# EAGLE board watchplb (EAGLE 6.5.0), part 1 of 2
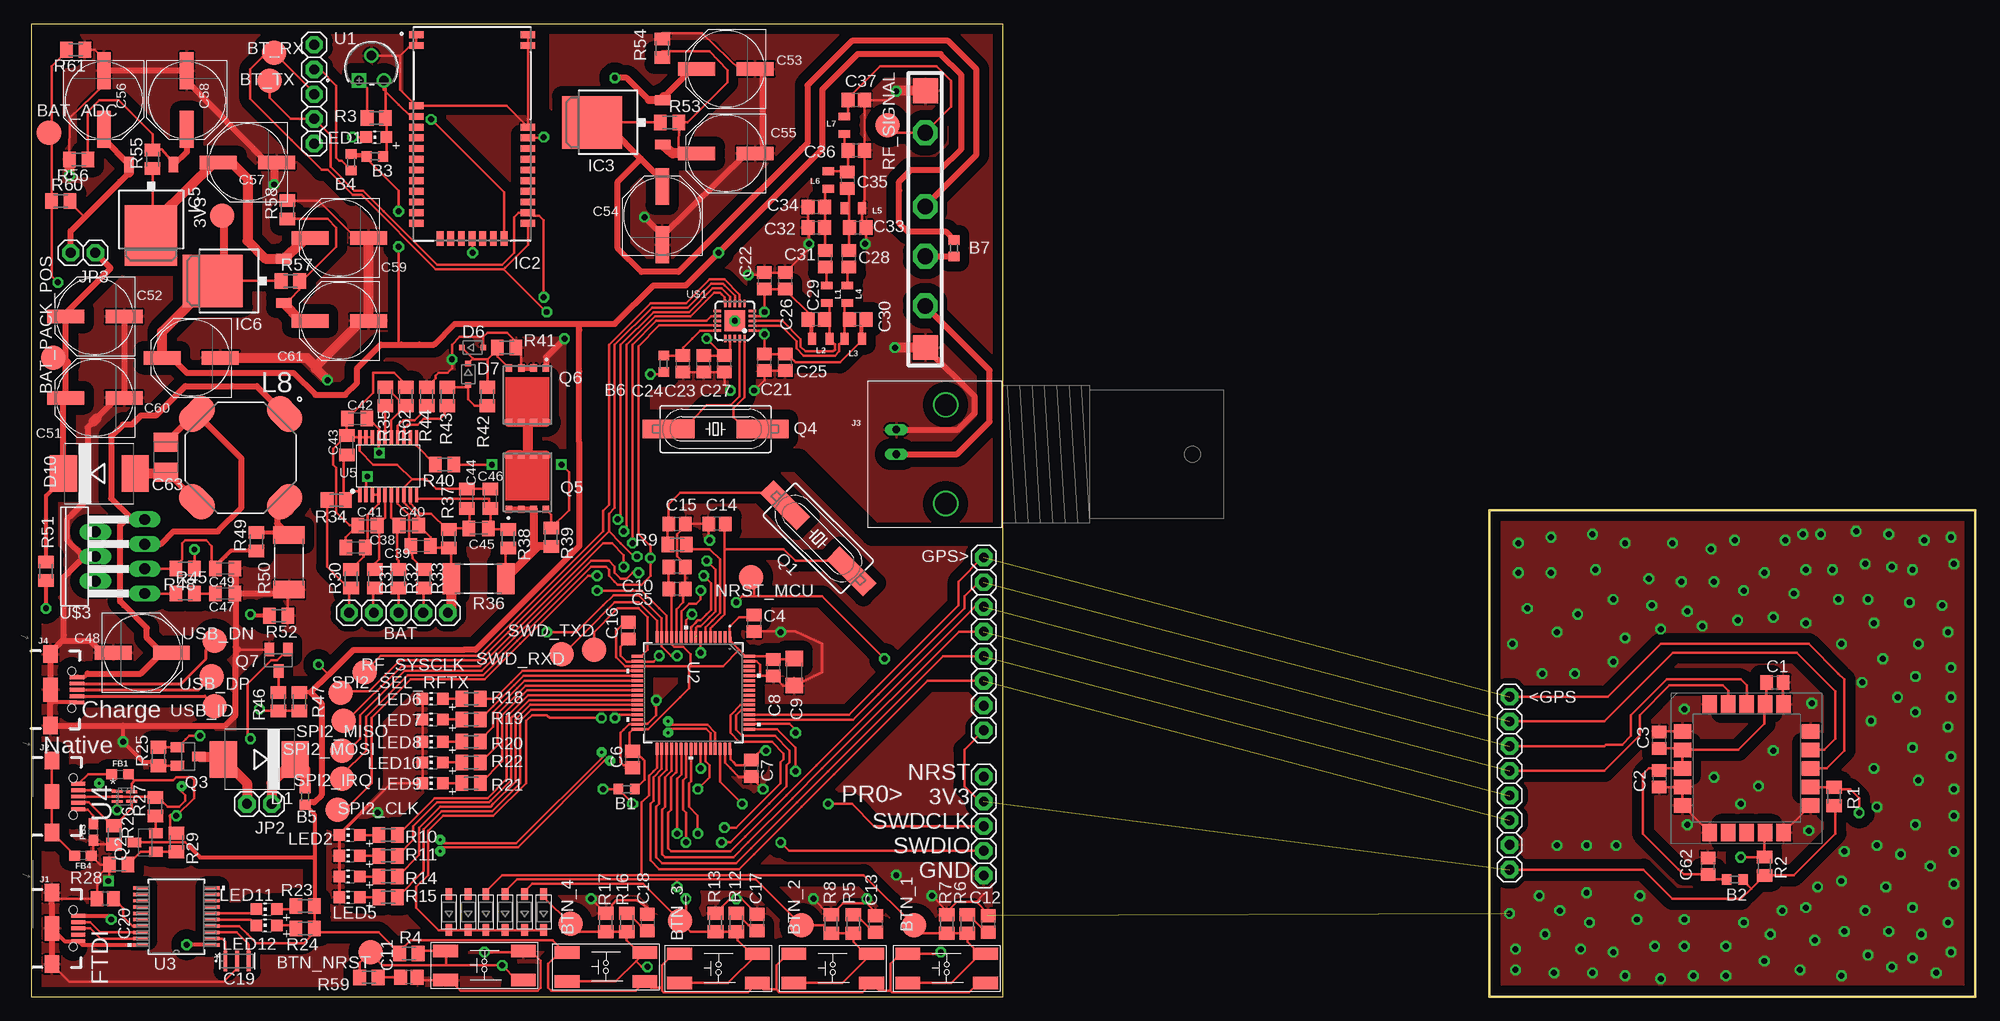
[diagram p2: board, top side]
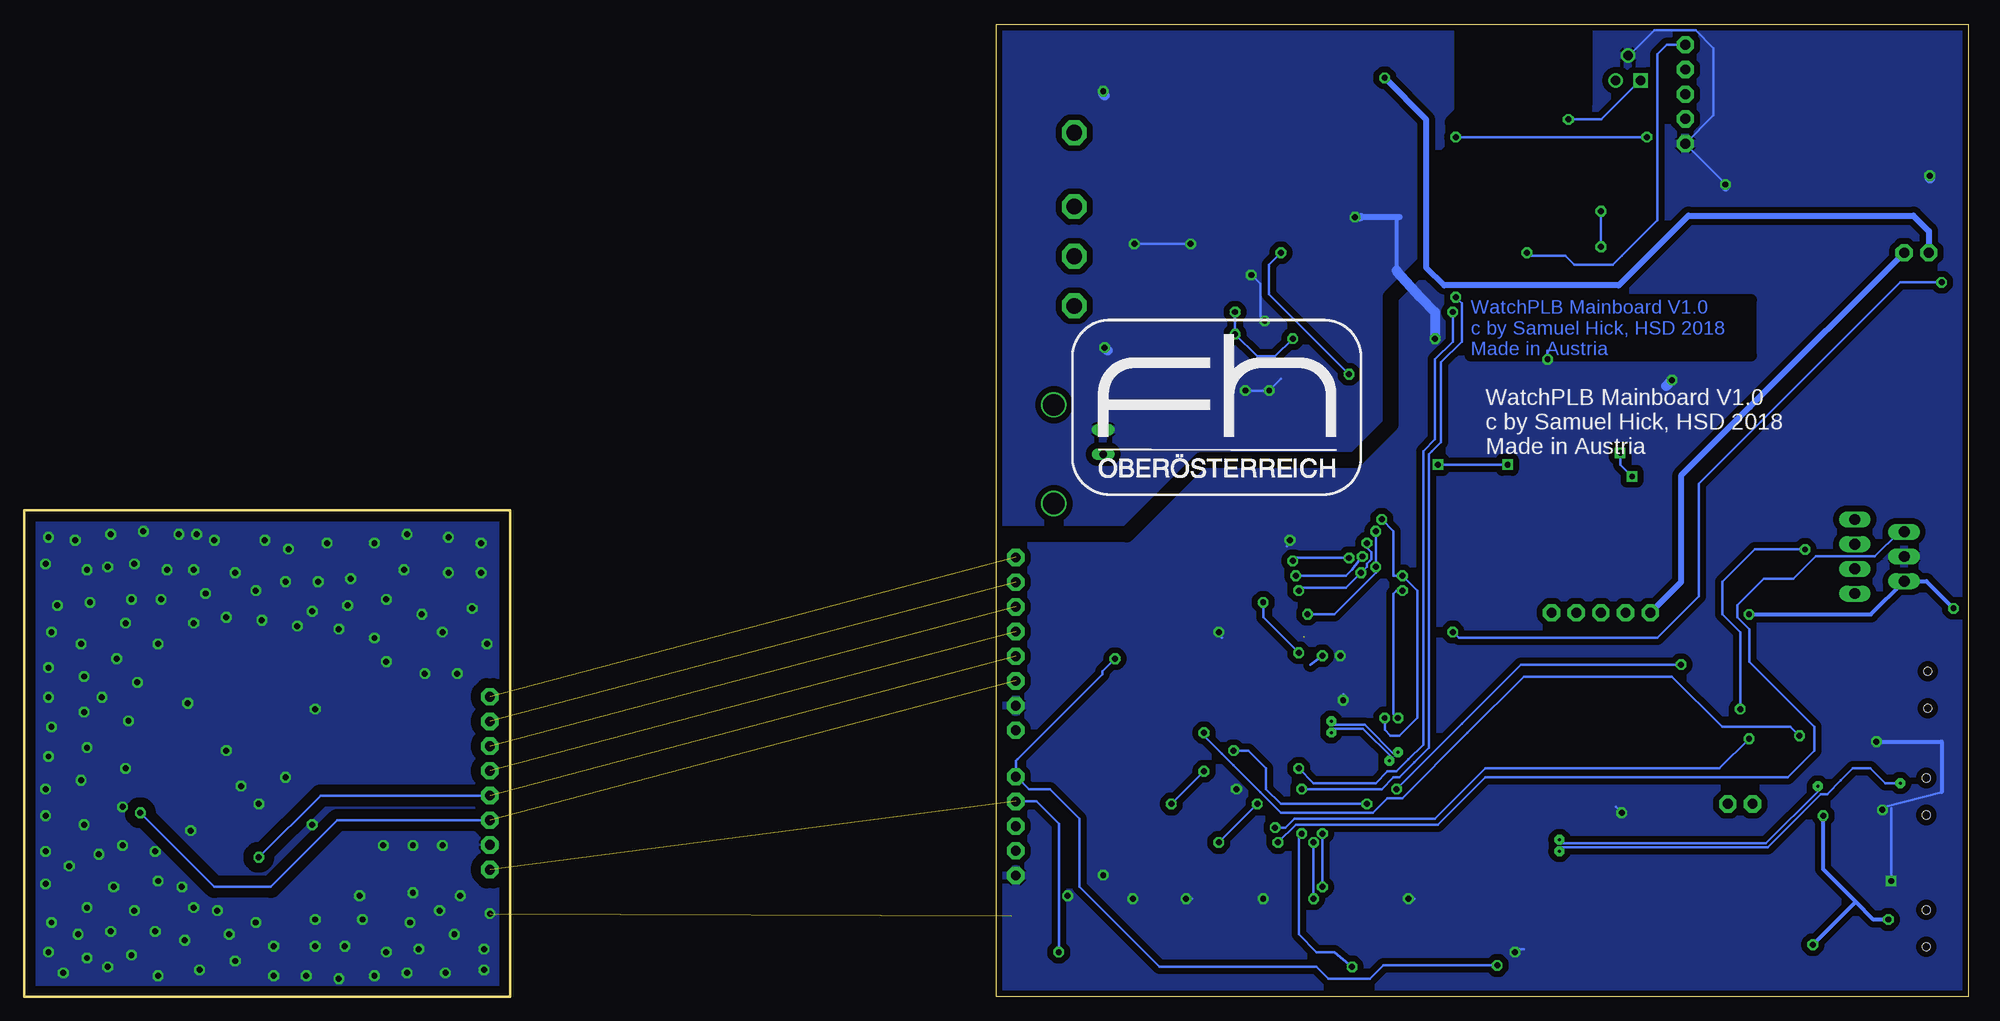
[diagram p3: board, bottom side, seen from below]

Size 200 x 100 mm. Coordinates in mm from the lower left corner, seen from the top.
Outline: 0,0 100,0 100,100 0,100 0,0
Outline: 200,50 200,0 150,0 150,50 200,50
Copper layers (1*16): Top 0.035mm / dielectric 1.5mm / Bottom 0.035mm
Design rules "PCB-POOL Standard *": minimum track width 0.15mm, minimum drill 0.3mm, track to track 0.15mm, track to pad 0.15mm, pad to pad 0.15mm, via to via 0.15mm, smd to smd 0.15mm, copper to edge 0.3mm, drill to drill 0.2mm, minimum pad ring 0.2mm, minimum via ring 0.15mm, stop-mask expansion 0.075mm, vias tented up to drill 0mil, thermal gap 0.2mm
tRestrict: area 39.3,91.7 to 51.2,99.7; 14 lines
bRestrict: area 39.3,91.7 to 51.2,99.7; 11 lines

## Footprints (pad centres in the part's own frame; a part is rotated, then mirrored left to right if it is on the bottom)
B2,54 = smd 2.54 x 2.54: TP 0,0
1X08 = drill 1.016 pad 1.778 octagon: 1 -8.89,0; 2 -6.35,0; 3 -3.81,0; 4 -1.27,0; 5 1.27,0; 6 3.81,0; 7 6.35,0; 8 8.89,0
L0603 = smd 1 x 1.1: 1 -0.85,0; 2 0.85,0
1X05 = drill 1.016 pad 1.778 octagon: 1 -5.08,0; 2 -2.54,0; 3 0,0; 4 2.54,0; 5 5.08,0
C0805 = smd 1.3 x 1.5: 1 -0.85,0; 2 0.85,0
C1206 = smd 1.6 x 1.8: 1 -1.4,0; 2 1.4,0
CSTCE = smd 0.406 x 2.108: 1 -1.2,0; 2 0,0; 3 1.2,0
C0805K = smd 1.3 x 1.6: 1 -1,0; 2 1,0
PANASONIC_E = smd 3.8 x 1.4: + 3,0; - -3,0
B/3528-21R = smd 1.95 x 2.5: + 1.525,0; - -1.525,0
SMC = smd 2.8 x 3.8: A 3.7,0; C -3.7,0
SOD-123 = smd 1.2 x 0.7: A 1.85,0; C -1.85,0
SOD323-R = smd 0.6 x 0.6: A 1.1,0; C -1.1,0
0603 = smd 1.1 x 1: 1 -0.85,0; 2 0.85,0
SAM-M8Q = smd 1.8 x 1.5: 1 -6.6,3.8; 2 -6.6,1.9; 3 -6.6,0; 4 -6.6,-1.9; 5 -6.6,-3.8; 11 6.6,-3.8; 12 6.6,-1.9; 13 6.6,0; 14 6.6,1.9; 15 6.6,3.8 | smd 1.5 x 1.8: 6 -3.8,-6.6; 7 -1.9,-6.6; 8 0,-6.6; 9 1.9,-6.6; 10 3.8,-6.6; 16 3.8,6.6; 17 1.9,6.6; 18 0,6.6; 19 -1.9,6.6; 20 -3.8,6.6
BM78SPPS5NC2_1 = smd 1.5 x 0.7: 1 -11.75,21.2; 2 -11.75,20.1; 3 -11.75,13.9; 4 -11.75,12.8; 5 -11.75,11.7; 6 -11.75,10.6; 7 -11.75,9.5; 8 -11.75,8.4; 9 -11.75,7.3; 10 -11.75,6.2; 11 -11.75,5.1; 12 -11.75,4; 13 -11.75,2.9; 14 -11.75,1.8; 22 -0.25,1.8; 23 -0.25,2.9; 24 -0.25,4; 25 -0.25,5.1; 26 -0.25,6.2; 27 -0.25,7.3; 28 -0.25,8.4; 29 -0.25,9.5; 30 -0.25,10.6; 31 -0.25,11.7; 32 -0.25,20.1; 33 -0.25,21.2 | smd 0.7 x 1.5: 15 -9.3,0.25; 16 -8.2,0.25; 17 -7.1,0.25; 18 -6,0.25; 19 -4.9,0.25; 20 -3.8,0.25; 21 -2.7,0.25
TO252 = smd 1 x 1.6: 1 -2.28,-4.8; 2 2.28,-4.8 | smd 5.4 x 6.2: TAB 0,2.5
USB-B-MICRO-SMD = smd 1.45 x 0.4: D+ 2.725,0; D- 2.725,0.65; GND 2.725,-1.3; ID 2.725,-0.65; VBUS 2.725,1.3 | smd 1.5 x 1.8: SHIELD1 0,3.685; SHIELD2 0,-3.685 | smd 1.5 x 2.5: SHIELD3 0,0 | hole 0.85: 2.2,1.9; 2.2,-1.9
BNC = drill 2.2: 3 -5.08,5.08; 4 5.08,5.08 | drill 0.8 long: GND -2.54,0; S 0,0
1X02 = drill 1.016 pad 1.778 octagon: 1 -1.27,0; 2 1.27,0
0805 = smd 0.8 x 1.2: 1 -0.9,0; 2 0.9,0
INDM115115X635N = smd 2.769 x 4.064: 1 -6.375,0; 3 6.375,0 | smd 4.064 x 2.769: 2 0,-6.375; 4 0,6.375
CHIP-LED0805 = smd 1.2 x 1.2: A 0,-1.05; C 0,1.05
HC49UP = smd 5.334 x 1.93: 1 -4.826,0; 2 4.826,0
SOT23-BEC = smd 1 x 1.4: B -0.95,-1.1; C 0,1.1; E 0.95,-1.1
SOT23 = smd 1 x 1.4: 1 -0.95,-1.1; 2 0.95,-1.1; 3 0,1.1
TRANS_CSD18534Q5A = smd 0.75 x 0.68: 1 -2.77,1.905; 2 -2.77,0.635; 3 -2.77,-0.635; 4 -2.77,-1.905 | smd 0.66 x 0.68: 5 2.78,-1.905; 6 2.78,-0.635; 7 2.78,0.635; 8 2.78,1.905
M0805 = smd 1.3 x 1.6: 1 -0.95,0; 2 0.95,0
R2512 = smd 1.8 x 3.2: 1 -2.8,0; 2 2.8,0
SMD_SWITCH = smd 2.54 x 1.27: P$1 4,1.5; P$2 -4,-1.5; P$3 -4,1.5; P$4 4,-1.5
TO-92_MC = drill 0.991 pad 1.499 square: 1 -2.54,-2.54 | drill 0.991 pad 1.499: 2 -1.27,0; 3 0,-2.54
LQFP64-10X10MM = smd 1.194 x 0.305: 1 -5.75,3.75; 2 -5.75,3.25; 3 -5.75,2.75; 4 -5.75,2.25; 5 -5.75,1.75; 6 -5.75,1.25; 7 -5.75,0.75; 8 -5.75,0.25; 9 -5.75,-0.25; 10 -5.75,-0.75; 11 -5.75,-1.25; 12 -5.75,-1.75; 13 -5.75,-2.25; 14 -5.75,-2.75; 15 -5.75,-3.25; 16 -5.75,-3.75; 33 5.75,-3.75; 34 5.75,-3.25; 35 5.75,-2.75; 36 5.75,-2.25; 37 5.75,-1.75; 38 5.75,-1.25; 39 5.75,-0.75; 40 5.75,-0.25; 41 5.75,0.25; 42 5.75,0.75; 43 5.75,1.25; 44 5.75,1.75; 45 5.75,2.25; 46 5.75,2.75; 47 5.75,3.25; 48 5.75,3.75 | smd 0.305 x 1.194: 17 -3.75,-5.75; 18 -3.25,-5.75; 19 -2.75,-5.75; 20 -2.25,-5.75; 21 -1.75,-5.75; 22 -1.25,-5.75; 23 -0.75,-5.75; 24 -0.25,-5.75; 25 0.25,-5.75; 26 0.75,-5.75; 27 1.25,-5.75; 28 1.75,-5.75; 29 2.25,-5.75; 30 2.75,-5.75; 31 3.25,-5.75; 32 3.75,-5.75; 49 3.75,5.75; 50 3.25,5.75; 51 2.75,5.75; 52 2.25,5.75; 53 1.75,5.75; 54 1.25,5.75; 55 0.75,5.75; 56 0.25,5.75; 57 -0.25,5.75; 58 -0.75,5.75; 59 -1.25,5.75; 60 -1.75,5.75; 61 -2.25,5.75; 62 -2.75,5.75; 63 -3.25,5.75; 64 -3.75,5.75
SSOP20_MC = smd 1.473 x 0.356: 1 -3.708,2.926; 2 -3.708,2.276; 3 -3.708,1.626; 4 -3.708,0.975; 5 -3.708,0.325; 6 -3.708,-0.325; 7 -3.708,-0.975; 8 -3.708,-1.626; 9 -3.708,-2.276; 10 -3.708,-2.926; 11 3.708,-2.926; 12 3.708,-2.276; 13 3.708,-1.626; 14 3.708,-0.975; 15 3.708,-0.325; 16 3.708,0.325; 17 3.708,0.975; 18 3.708,1.626; 19 3.708,2.276; 20 3.708,2.926
SOT50P160X60-5N = smd 1.118 x 0.254: 1 -0.737,0.508; 2 -0.737,0; 3 -0.737,-0.508 | smd 1.118 x 0.305: 4 0.737,-0.508; 5 0.737,0.508
TSSOP-20/6MM = smd 1.5 x 0.35: 1 -2.95,2.925; 2 -2.95,2.275; 3 -2.95,1.625; 4 -2.95,0.975; 5 -2.95,0.325; 6 -2.95,-0.325; 7 -2.95,-0.975; 8 -2.95,-1.625; 9 -2.95,-2.275; 10 -2.95,-2.925; 11 2.95,-2.925; 12 2.95,-2.275; 13 2.95,-1.625; 14 2.95,-0.975; 15 2.95,-0.325; 16 2.95,0.325; 17 2.95,0.975; 18 2.95,1.625; 19 2.95,2.275; 20 2.95,2.925
QFN20 = smd 0.25 x 0.75: 1 -1,-1.8; 2 -0.5,-1.8; 3 0,-1.8; 4 0.5,-1.8; 5 1,-1.8; 11 1,1.8; 12 0.5,1.8; 13 0,1.8; 14 -0.5,1.8; 15 -1,1.8 | smd 0.75 x 0.25: 6 1.8,-1; 7 1.8,-0.5; 8 1.8,0; 9 1.8,0.5; 10 1.8,1; 16 -1.8,1; 17 -1.8,0.5; 18 -1.8,0; 19 -1.8,-0.5; 20 -1.8,-1 | smd 2.15 x 2.15: PAD 0,0
RA07H4047M = drill 1.6 pad 2.54 octagon: 1 6.1,1.75; 2 13.7,1.75; 3 18.8,1.75; 4 23.9,1.75 | smd 2.54 x 2.54: 5_L 1.778,1.778; 5_R 28.194,1.778
TO220-7 = drill 1.118 pad 1.626 long: 1 -3.81,-8.636; 2 -2.54,-3.556; 3 -1.27,-8.636; 4 0,-3.556; 5 1.27,-8.636; 6 2.54,-3.556; 7 3.81,-8.636

## Placement (x,y rotation side)
3V3  PTR1B2,54  [B2,54]  19.66,80.31 90 top
<GPS  [1X08]  152.1,21.95 90 top
B1  BLM18KG601SN1D  [L0603]  61.26,21.34 0 top
B2  BLM18KG601SN1D  [L0603]  175.26,12.04 180 top
B3  BLM18KG601SN1D  [L0603]  35.36,86.41 0 top
B4  BLM18KG601SN1D  [L0603]  32.92,85.8 270 top
B5  BLM18KG601SN1D  [L0603]  28.19,20.57 90 top
B6  BLM18KG601SN1D  [L0603]  65.07,65.07 90 top
B7  BLM18KG601SN1D  [L0603]  94.95,76.96 270 top
BAT  [1X05]  37.8,39.47 0 top
BAT_ADC  PTR1B2,54  [B2,54]  1.83,88.85 0 top
BAT_PACK_POS  PTR1B2,54  [B2,54]  2.29,65.68 0 top
BT_RX  PTR1B2,54  [B2,54]  24.99,97.08 0 top
BT_TX  PTR1B2,54  [B2,54]  24.54,94.18 0 top
BTN_1  PTR1B2,54  [B2,54]  90.83,7.32 180 top
BTN_2  PTR1B2,54  [B2,54]  79.25,7.32 180 top
BTN_3  PTR1B2,54  [B2,54]  66.75,7.77 180 top
BTN_4  PTR1B2,54  [B2,54]  55.47,7.47 180 top
BTN_NRST  PTR1B2,54  [B2,54]  34.9,4.57 180 top
C1  1uF  [C0805]  179.37,32.31 0 top
C2  1uF  [C0805]  167.49,22.4 270 top
C3  1uF  [C0805]  167.49,26.37 90 top
C4  100nF  [C0805]  74.37,38.4 270 top
C5  100nF  [C0805]  66.45,41.91 180 top
C6  100nF  [C0805]  61.87,24.38 90 top
C7  100nF  [C0805]  74.07,23.47 270 top
C8  100nF  [C0805]  76.35,33.83 270 top
C9  10uF  [C1206]  78.49,33.38 270 top
C10  1uF  [C0805]  66.45,44.2 180 top
C11  100nF  [C0805]  38.86,1.98 180 top
C12  100nF  [C0805]  98.45,7.47 270 top
C13  100nF  [C0805]  86.87,7.47 270 top
C14  27p  [C0805]  70.56,48.62 180 top
C15  27p  [C0805]  66.45,48.62 0 top
C16  100nF  [C0805]  61.42,37.64 90 top
C17  100nF  [C0805]  74.68,7.62 270 top
C18  100nF  [C0805]  63.4,7.62 270 top
C19  CSTCE12M0G15L99-R0  [CSTCE]  21.18,3.66 0 top
C20  1uF  [C0805]  7.62,10.06 180 top
C21  100nF  [C0805]  75.44,65.23 90 top
C22  100nF  [C0805]  75.44,73.61 270 top
C23  100nF  [C0805]  69.19,65.07 90 top
C24  100nF  [C0805]  67.06,65.07 90 top
C25  27pF  [C0805]  77.57,65.23 90 top
C26  27pF  [C0805]  77.57,73.61 270 top
C27  1uF  [C0805]  71.32,65.07 90 top
C28  [C0805]  84.12,75.9 90 top
C29  [C0805]  80.77,69.65 180 top
C30  [C0805]  85.04,69.65 180 top
C31  [C0805]  81.69,75.9 90 top
C32  [C0805]  80.77,79.1 0 top
C33  [C0805]  85.04,79.1 0 top
C34  [C0805]  80.77,81.23 0 top
C35  [C0805]  83.97,83.97 270 top
C36  [C0805]  84.89,87.02 180 top
C37  [C0805]  84.89,92.2 180 top
C38  100nF  [C0805K]  33.38,46.18 180 top
C39  100nF  [C0805K]  40.08,46.33 0 top
C40  100nF  [C0805K]  38.86,48.46 0 top
C41  100nF  [C0805K]  34.59,48.46 180 top
C42  1uF  [C0805K]  33.53,59.44 0 top
C43  1uF  [C0805K]  32.46,56.69 90 top
C44  100nF  [C0805K]  44.81,51.21 270 top
C45  100nF  [C0805K]  46.02,48.16 0 top
C46  100nF  [C0805K]  47.24,51.21 90 top
C47  100nF  [C0805K]  19.96,41.45 180 top
C48  22uF 80-EDK226M050A9GAA  [PANASONIC_E]  11.43,35.36 0 top
C49  100nF  [C0805K]  19.96,44.04 180 top
C51  22uF 80-EDK226M050A9GAA  [PANASONIC_E]  6.55,61.57 180 top
C52  22uF 80-EDK226M050A9GAA  [PANASONIC_E]  6.55,69.95 180 top
C53  10uF 80-EDK106M025A9DAA  [PANASONIC_E]  71.48,95.4 180 top
C54  100uF 647-GYA1E101MCQ1GS  [PANASONIC_E]  64.92,80.31 90 top
C55  NP  [PANASONIC_E]  71.48,86.72 180 top
C56  10uF 80-EDK106M025A9DAA  [PANASONIC_E]  7.47,92.2 270 top
C57  100uF 647-GYA1E101MCQ1GS  [PANASONIC_E]  22.25,85.8 180 top
C58  NP  [PANASONIC_E]  16,92.2 270 top
C59  10uF 80-EDK106M025A9DAA  [PANASONIC_E]  31.7,78.03 180 top
C60  100uF 647-GYA1E101MCQ1GS  [PANASONIC_E]  16.46,65.68 180 top
C61  NP  [PANASONIC_E]  31.7,69.49 180 top
C62  4.7uF  [C0805]  172.52,13.41 90 top
C63  4.7uF low esr 80-T521B475M35ATE150  [B/3528-21R]  13.87,55.47 90 top
CONFIG_INTERFACE_TEST_POINT  [1X05]  29.11,92.81 270 top
D1  S8NC-13  [SMC]  23.47,24.38 180 top
D2  [SOD-123]  46.79,8.69 90 top
D3  [SOD-123]  48.77,8.69 90 top
D4  [SOD-123]  50.75,8.69 90 top
D5  [SOD-123]  52.73,8.69 90 top
D6  Zener 16V MMSZ5246BS-7-F  [SOD323-R]  45.42,66.75 0 top
D7  100V, BAS16J,135  [SOD323-R]  44.96,64.01 270 top
D8  [SOD-123]  44.96,8.69 90 top
D9  [SOD-123]  42.98,8.69 90 top
D10  MBRS330T3  [SMC]  7.01,53.8 0 top
FB1  BLM18PG300SN1D  [0603]  9.14,22.86 0 top
FB3  BLM18PG300SN1D  [0603]  6.4,16.92 90 top
FB4  BLM18PG300SN1D  [0603]  5.33,14.48 180 top
GPS>  [1X08]  97.99,36.27 90 top
IC1  SAM-M8Q  [SAM-M8Q]  176.48,23.47 0 top
IC2  BM70BLES1FC2-0B03AA  [BM78SPPS5NC2_1]  51.36,77.72 0 top
IC3  LM1117DTX-ADJ-12V  [TO252]  60.2,89.92 90 top
IC5  LM1117DTX-ADJ-10V  [TO252]  12.34,80.77 180 top
IC6  LM1117DTX-ADJ-3V3  [TO252]  21.18,73.61 90 top
J1  [USB-B-MICRO-SMD]  2.13,7.01 0 top
J2  [USB-B-MICRO-SMD]  2.13,20.57 0 top
J3  BNCPTH  [BNC]  89,55.78 270 top
J4  [USB-B-MICRO-SMD]  1.98,31.55 0 top
JP2  VIB_MOTOR, 619-28821  [1X02]  23.47,19.81 180 top
JP3  Power Disconnect  [1X02]  5.33,76.5 180 top
L1  [0805]  81.84,72.24 270 top
L2  [0805]  81.23,67.67 0 top
L3  [0805]  84.58,67.67 0 top
L4  [0805]  83.97,72.24 270 top
L5  [0805]  84.58,81.08 180 top
L6  [0805]  81.99,83.97 90 top
L7  [0805]  83.67,89.61 90 top
L8  CTX10-4A-R  [INDM115115X635N]  21.57,55.4 225 top
LED1  BLUE  [CHIP-LED0805]  35.51,88.39 90 top
LED2  GREEN  [CHIP-LED0805]  32.77,16.61 90 top
LED3  BLUE  [CHIP-LED0805]  32.77,14.48 90 top
LED4  WHITE  [CHIP-LED0805]  32.77,12.34 90 top
LED5  RED  [CHIP-LED0805]  32.77,10.21 90 top
LED6  GREEN  [CHIP-LED0805]  41.3,30.63 90 top
LED7  GREEN  [CHIP-LED0805]  41.3,28.5 90 top
LED8  GREEN  [CHIP-LED0805]  41.3,26.21 90 top
LED9  RED  [CHIP-LED0805]  41.3,21.95 90 top
LED10  YELLOW  [CHIP-LED0805]  41.3,24.08 90 top
LED11  GREEN  [CHIP-LED0805]  24.23,8.99 90 top
LED12  RED  [CHIP-LED0805]  24.23,7.32 90 top
NRST_MCU  PTR1B2,54  [B2,54]  74.07,43.13 180 top
PR0>  SWD  [1X05]  97.99,17.53 90 top
Q1  8MHz / LFXTAL020423Reel  [HC49UP]  80.97,47.14 315 top
Q2  BC817-25SMD  [SOT23-BEC]  11.73,15.85 90 top
Q3  DMN3023L-7  [SOT23]  16.15,24.69 270 top
Q4  16MHz_LFXTAL051370Reel  [HC49UP]  70.41,58.37 180 top
Q5  CSD18534Q5A  [TRANS_CSD18534Q5A]  51.05,52.88 90 top
Q6  CSD18534Q5A  [TRANS_CSD18534Q5A]  51.05,61.87 270 top
Q7  DMN3023L-7  [SOT23]  25.45,34.59 180 top
R1  47k  [M0805]  185.47,20.57 90 top
R2  47k  [M0805]  178.31,13.41 90 top
R3  4k7  [M0805]  35.51,90.37 180 top
R4  47k  [M0805]  38.86,4.42 0 top
R5  10k  [M0805]  84.58,7.47 270 top
R6  10k  [M0805]  96.32,7.47 270 top
R7  10k  [M0805]  94.18,7.47 90 top
R8  10k  [M0805]  82.3,7.47 90 top
R9  220R  [M0805]  66.45,46.48 0 top
R10  470R  [M0805]  36.73,16.61 0 top
R11  470R  [M0805]  36.73,14.48 0 top
R12  10k  [M0805]  72.54,7.62 270 top
R13  10k  [M0805]  70.41,7.62 90 top
R14  470R  [M0805]  36.73,12.34 0 top
R15  470R  [M0805]  36.73,10.21 0 top
R16  10k  [M0805]  61.26,7.62 270 top
R17  10k  [M0805]  59.13,7.62 90 top
R18  470R  [M0805]  45.26,30.63 180 top
R19  470R  [M0805]  45.26,28.5 180 top
R20  470R  [M0805]  45.26,26.21 180 top
R21  470R  [M0805]  45.26,21.95 180 top
R22  470R  [M0805]  45.26,24.08 180 top
R23  220R  [M0805]  28.19,9.3 180 top
R24  220R  [M0805]  28.19,7.01 180 top
R25  100k  [M0805]  13.11,24.69 270 top
R26  100k  [M0805]  8.53,16.61 270 top
R27  x  [M0805]  12.8,19.51 90 top
R28  x  [M0805]  8.99,13.56 180 top
R29  x  [M0805]  14.94,15.85 270 top
R30  1k  [M0805]  32.92,42.98 90 top
R31  1k  [M0805]  35.36,42.98 90 top
R32  1k  [M0805]  37.8,42.98 90 top
R33  1k  [M0805]  40.39,42.98 90 top
R34  1k  [M0805]  31.39,51.05 0 top
R35  10k  [M0805]  36.42,61.72 90 top
R36  20mR  [R2512]  46.02,42.98 180 top
R37  100R  [M0805]  42.98,47.09 270 top
R38  100R  [M0805]  49.07,47.09 270 top
R39  10M  [M0805]  53.49,47.24 270 top
R40  5k1  [M0805]  42.52,54.71 180 top
R41  3M3  [M0805]  48.92,66.75 180 top
R42  1M  [M0805]  46.94,61.72 270 top
R43  5k1  [M0805]  42.82,61.72 90 top
R44  470k  [M0805]  40.69,61.72 90 top
R45  330  [M0805]  15.85,41.45 0 top
R46  910R  [M0805]  25.45,30.33 270 top
R47  10k  [M0805]  27.58,30.33 270 top
R48  330k  [M0805]  15.85,44.04 180 top
R49  10k  [M0805]  23.16,46.79 90 top
R50  0.25R  [R2512]  26.52,44.65 90 top
R51  120k  [M0805]  1.52,43.74 90 top
R52  12k4  [M0805]  25.45,39.17 180 top
R53  5k1  [M0805]  65.68,89.92 0 top
R54  47k  [M0805]  64.92,97.54 90 top
R55  5k1  [M0805]  12.5,86.11 90 top
R56  47k  [M0805]  4.88,86.11 180 top
R57  5k1  [M0805]  26.67,73.61 0 top
R58  47k  [M0805]  26.37,80.92 90 top
R59  10k  [M0805]  34.75,1.98 180 top
R60  47k  [M0805]  3.05,81.84 0 top
R61  10k  [M0805]  4.57,97.38 180 top
R62  NTC 103AT  [M0805]  38.56,61.72 90 top
RF_SIGNAL  PTR1B2,54  [B2,54]  88.09,89.61 0 top
RF_SYSCLK  PTR1B2,54  [B2,54]  34.29,33.38 180 top
S1  [SMD_SWITCH]  46.63,3.2 180 top
S2  [SMD_SWITCH]  94.18,2.9 180 top
S3  [SMD_SWITCH]  82.45,2.9 180 top
S4  [SMD_SWITCH]  70.71,2.9 180 top
S5  [SMD_SWITCH]  59.13,3.05 180 top
SPI2_CLK  PTR1B2,54  [B2,54]  31.55,19.2 180 top
SPI2_IRQ  PTR1B2,54  [B2,54]  32,22.4 180 top
SPI2_MISO  PTR1B2,54  [B2,54]  32.16,28.35 180 top
SPI2_MOSI  PTR1B2,54  [B2,54]  32,25.3 180 top
SPI2_SEL_RFTX  PTR1B2,54  [B2,54]  31.85,31.24 180 top
SWD_RXD  PTR1B2,54  [B2,54]  54.56,35.2 180 top
SWD_TXD  PTR1B2,54  [B2,54]  57.91,35.66 180 top
U1  MCP111-XXXXX/TO  [TO-92_MC]  36.27,96.77 0 top
U2  STM32L073RZ  [LQFP64-10X10MM]  68.12,31.24 270 top
U3  MCP2200-I/SS  [SSOP20_MC]  14.94,8.23 180 top
U4  TPD3E001DRLR  [SOT50P160X60-5N]  9.6,20.57 0 top
U5  BQ7790504  [TSSOP-20/6MM]  36.73,54.56 90 top
U$1  AX5031  [QFN20]  72.39,69.49 90 top
U$2  RA07H4047M  [RA07H4047M]  90.22,94.95 270 top
U$3  LT1513  [TO220-7]  3.05,45.26 90 top
U$4  [FH_LOGO]  92.66,51.21 0 bottom
USB_DN  PTR1B2,54  [B2,54]  18.9,36.58 90 top
USB_DP  PTR1B2,54  [B2,54]  18.59,32.92 90 top
USB_ID  PTR1B2,54  [B2,54]  18.9,29.87 90 top